# Altium schematic sheet DAC.SchDoc
size A
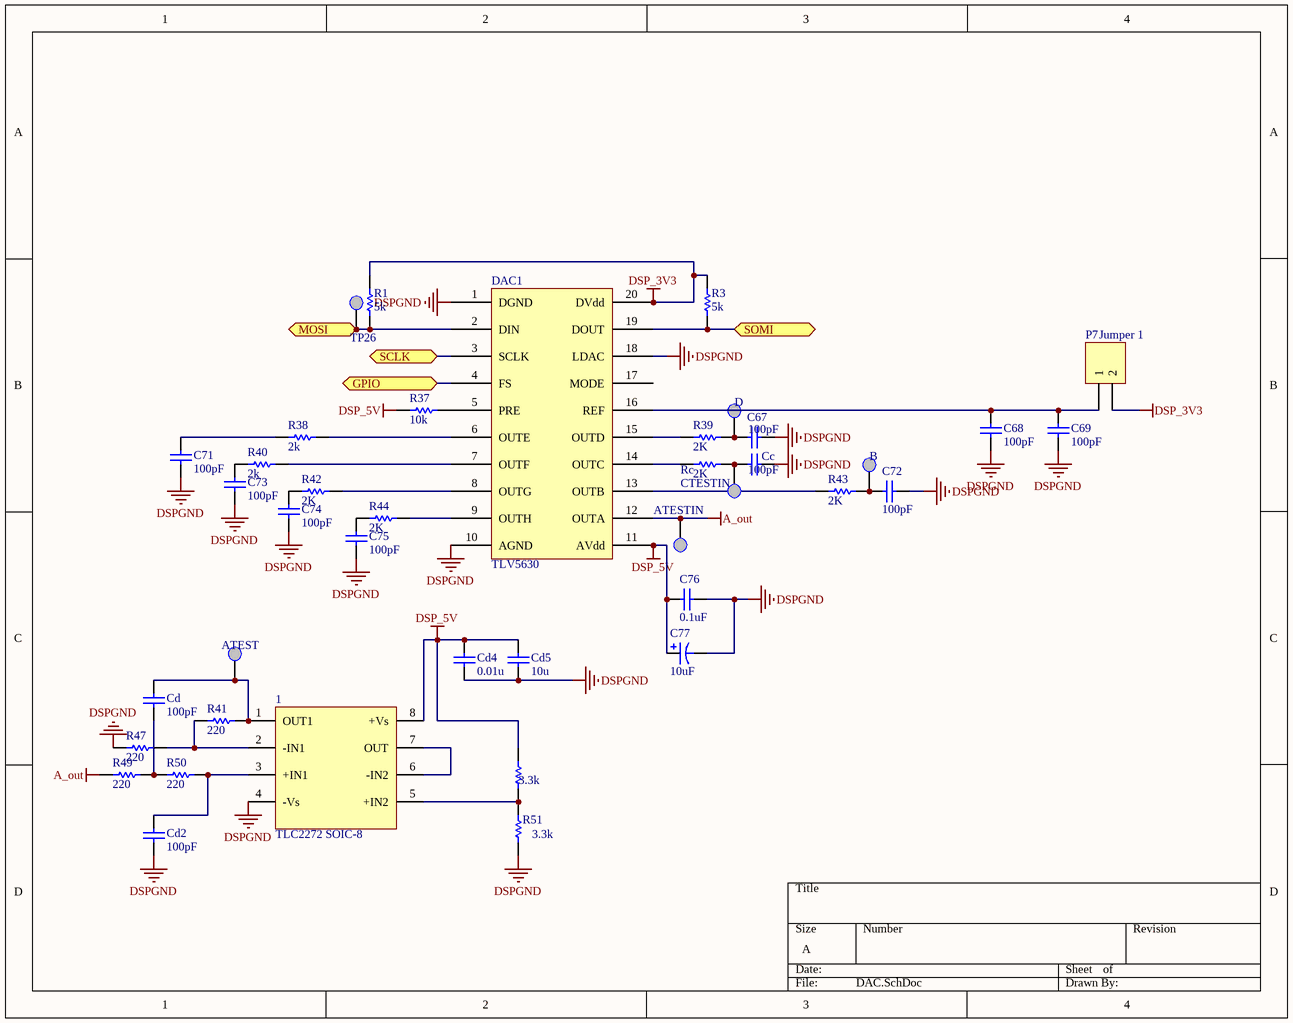
[diagram p0: DAC.SchDoc]

## Parts
1  TLC2272 SOIC-8  [AD8056]
3.3k  Res1  [0805 RES]  (value not drawn)
ATEST  Test point  [Test Point]  (value not drawn)
ATESTIN  Test point  [Test Point]  (value not drawn)
B  Test point  [Test Point]  (value not drawn)
C67  value 100pF  [Capacitor 0805]  (hidden comment: Cap)
C68  value 100pF  [Capacitor 0805]  (hidden comment: Cap)
C69  value 100pF  [Capacitor 0805]  (hidden comment: Cap)
C71  value 100pF  [Capacitor 0805]  (hidden comment: Cap)
C72  value 100pF  [Capacitor 0805]  (hidden comment: Cap)
C73  value 100pF  [Capacitor 0805]  (hidden comment: Cap)
C74  value 100pF  [Capacitor 0805]  (hidden comment: Cap)
C75  value 100pF  [Capacitor 0805]  (hidden comment: Cap)
C76  value 0.1uF  [Capacitor 0805]  (hidden comment: Cap)
C77  value 10uF  [Cap Tantal 3216]  (hidden comment: Tantalium/T520A226M006ATE090)
Cc  value 100pF  [Capacitor 0805]  (hidden comment: Cap)
Cd  value 100pF  [Capacitor 0805]  (hidden comment: Cap)
Cd2  value 100pF  [Capacitor 0805]  (hidden comment: Cap)
Cd4  value 0.01u  [Capacitor 0805]  (hidden comment: Cap)
Cd5  value 10u  [Capacitor 0805]  (hidden comment: Cap)
CTESTIN  Test point  [Test Point]  (value not drawn)
D  Test point  [Test Point]  (value not drawn)
DAC1  TLV5630  [TLV5630]
P7  Jumper 1  [HDR1X2]
R1  value 5k  [0805 RES]  (hidden comment: Res1)
R3  value 5k  [0805 RES]  (hidden comment: Res1)
R37  value 10k  [0805 RES]  (hidden comment: Res1)
R38  value 2k  [0805 RES]  (hidden comment: Res1)
R39  value 2K  [0805 RES]  (hidden comment: Res1)
R40  value 2k  [0805 RES]  (hidden comment: Res1)
R41  value 220  [0805 RES]  (hidden comment: Res1)
R42  value 2K  [0805 RES]  (hidden comment: Res1)
R43  value 2K  [0805 RES]  (hidden comment: Res1)
R44  value 2K  [0805 RES]  (hidden comment: Res1)
R47  value 220  [0805 RES]  (hidden comment: Res1)
R49  value 220  [0805 RES]  (hidden comment: Res1)
R50  value 220  [0805 RES]  (hidden comment: Res1)
R51  value 3.3k  [0805 RES]  (hidden comment: Res1)
Rc  value 2K  [0805 RES]  (hidden comment: Res1)
TP26  Test point  [Test Point]  (value not drawn)

## Ports
GPIO, MOSI, SCLK, SOMI

## Nets
A_out: ATESTIN.1 DAC1.12(OUTA) R49.1
DSP_3V3: DAC1.20(DVdd) P7.2 R1.2 R3.2
DSP_5V: 1.8(+Vs) 3.3k.2 C76.2 C77.1 Cd4.1 Cd5.1 DAC1.11(AVdd) R37.1
DSPGND: 1.4(-Vs) C67.2 C68.2 C69.2 C71.2 C72.2 C73.2 C74.2 C75.2 C76.1 C77.2 Cc.2 Cd2.2 Cd4.2 Cd5.2 DAC1.1(DGND) DAC1.10(AGND) DAC1.18(LDAC) R47.1 R51.1
GPIO: DAC1.4(FS) ; port GPIO
MOSI: DAC1.2(DIN) R1.1 TP26.1 ; port MOSI
SCLK: DAC1.3(SCLK) ; port SCLK
SOMI: DAC1.19(DOUT) R3.1 ; port SOMI
Net1_1: 1.1(OUT1) ATEST.1 Cd.1 R41.2
Net1_2: 1.2(-IN1) R41.1 R47.2
Net1_3: 1.3(+IN1) Cd2.1 R50.2
Net1_5: 1.5(+IN2) 3.3k.1 R51.2
Net1_6: 1.6(-IN2) 1.7(OUT)
NetB_1: B.1 C72.1 R43.2
NetC67_1: C67.1 D.1 R39.2
NetC68_1: C68.1 C69.1 DAC1.16(REF) P7.1
NetC71_1: C71.1 R38.1
NetC73_1: C73.1 R40.1
NetC74_1: C74.1 R42.2
NetC75_1: C75.1 R44.2
NetCc_1: Cc.1 CTESTIN.1 Rc.2
NetCd_2: Cd.2 R49.2 R50.1
NetDAC1_5: DAC1.5(PRE) R37.2
NetDAC1_6: DAC1.6(OUTE) R38.2
NetDAC1_7: DAC1.7(OUTF) R40.2
NetDAC1_8: DAC1.8(OUTG) R42.1
NetDAC1_9: DAC1.9(OUTH) R44.1
NetDAC1_13: DAC1.13(OUTB) R43.1
NetDAC1_14: DAC1.14(OUTC) Rc.1
NetDAC1_15: DAC1.15(OUTD) R39.1

Not connected (* = marked no-connect by the designer): DAC1 17(MODE)

## Library data of the parts
1 = AD8056
3.3k R1 R3 R37-R44 R47 R49-R51 Rc = Res1: Resistor; Published: 8-Jun-2000; Revision: July-2002: Re-released for DXP Platform.; Publisher: Altium Limited
C67-C69 C71-C76 Cc Cd Cd2 Cd4 Cd5 = Cap: Capacitor; Published: 8-Jun-2000; LatestRevisionDate: 17-Jul-2002; LatestRevisionNote: Re-released for DXP Platform.; PackageReference: RAD-0.3; Publisher: Altium Limited
C77 = Cap Pol1: Polarized Capacitor (Radial); Published: 8-Jun-2000; LatestRevisionDate: 17-Jul-2002; LatestRevisionNote: Re-released for DXP Platform.; PackageReference: RB7.6-15; Publisher: Altium Limited
P7 = Header 2: Header, 2-Pin; LatestRevisionDate: 17-Jul-2002; LatestRevisionNote: Re-released for DXP Platform.; Publisher: Altium Limited